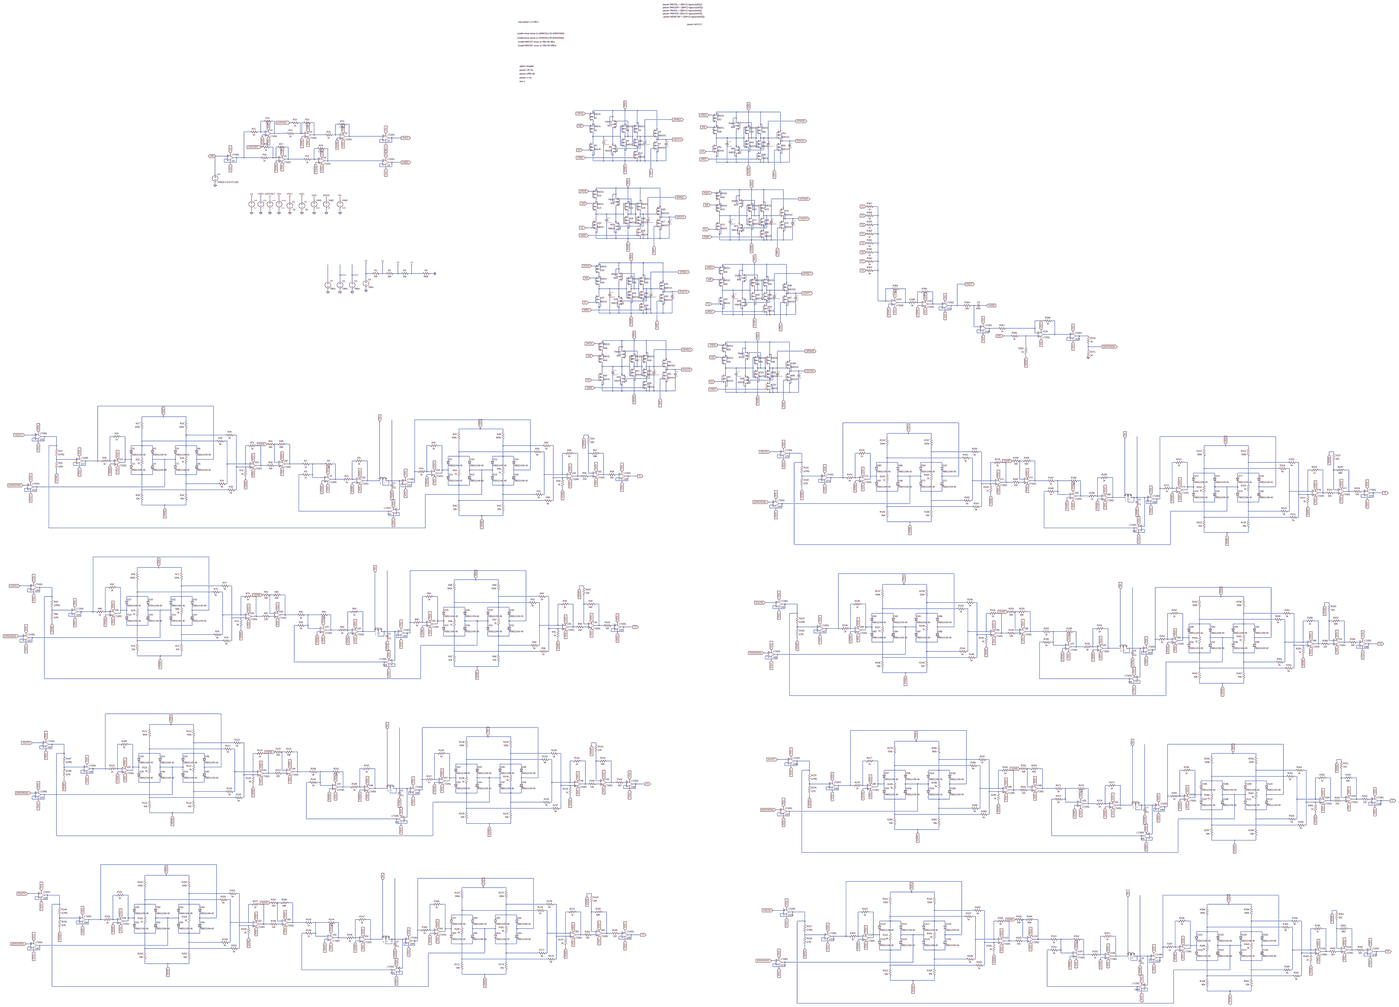
[diagram p0: schematic OZ_8_bounded_curves.asc, whole sheet]
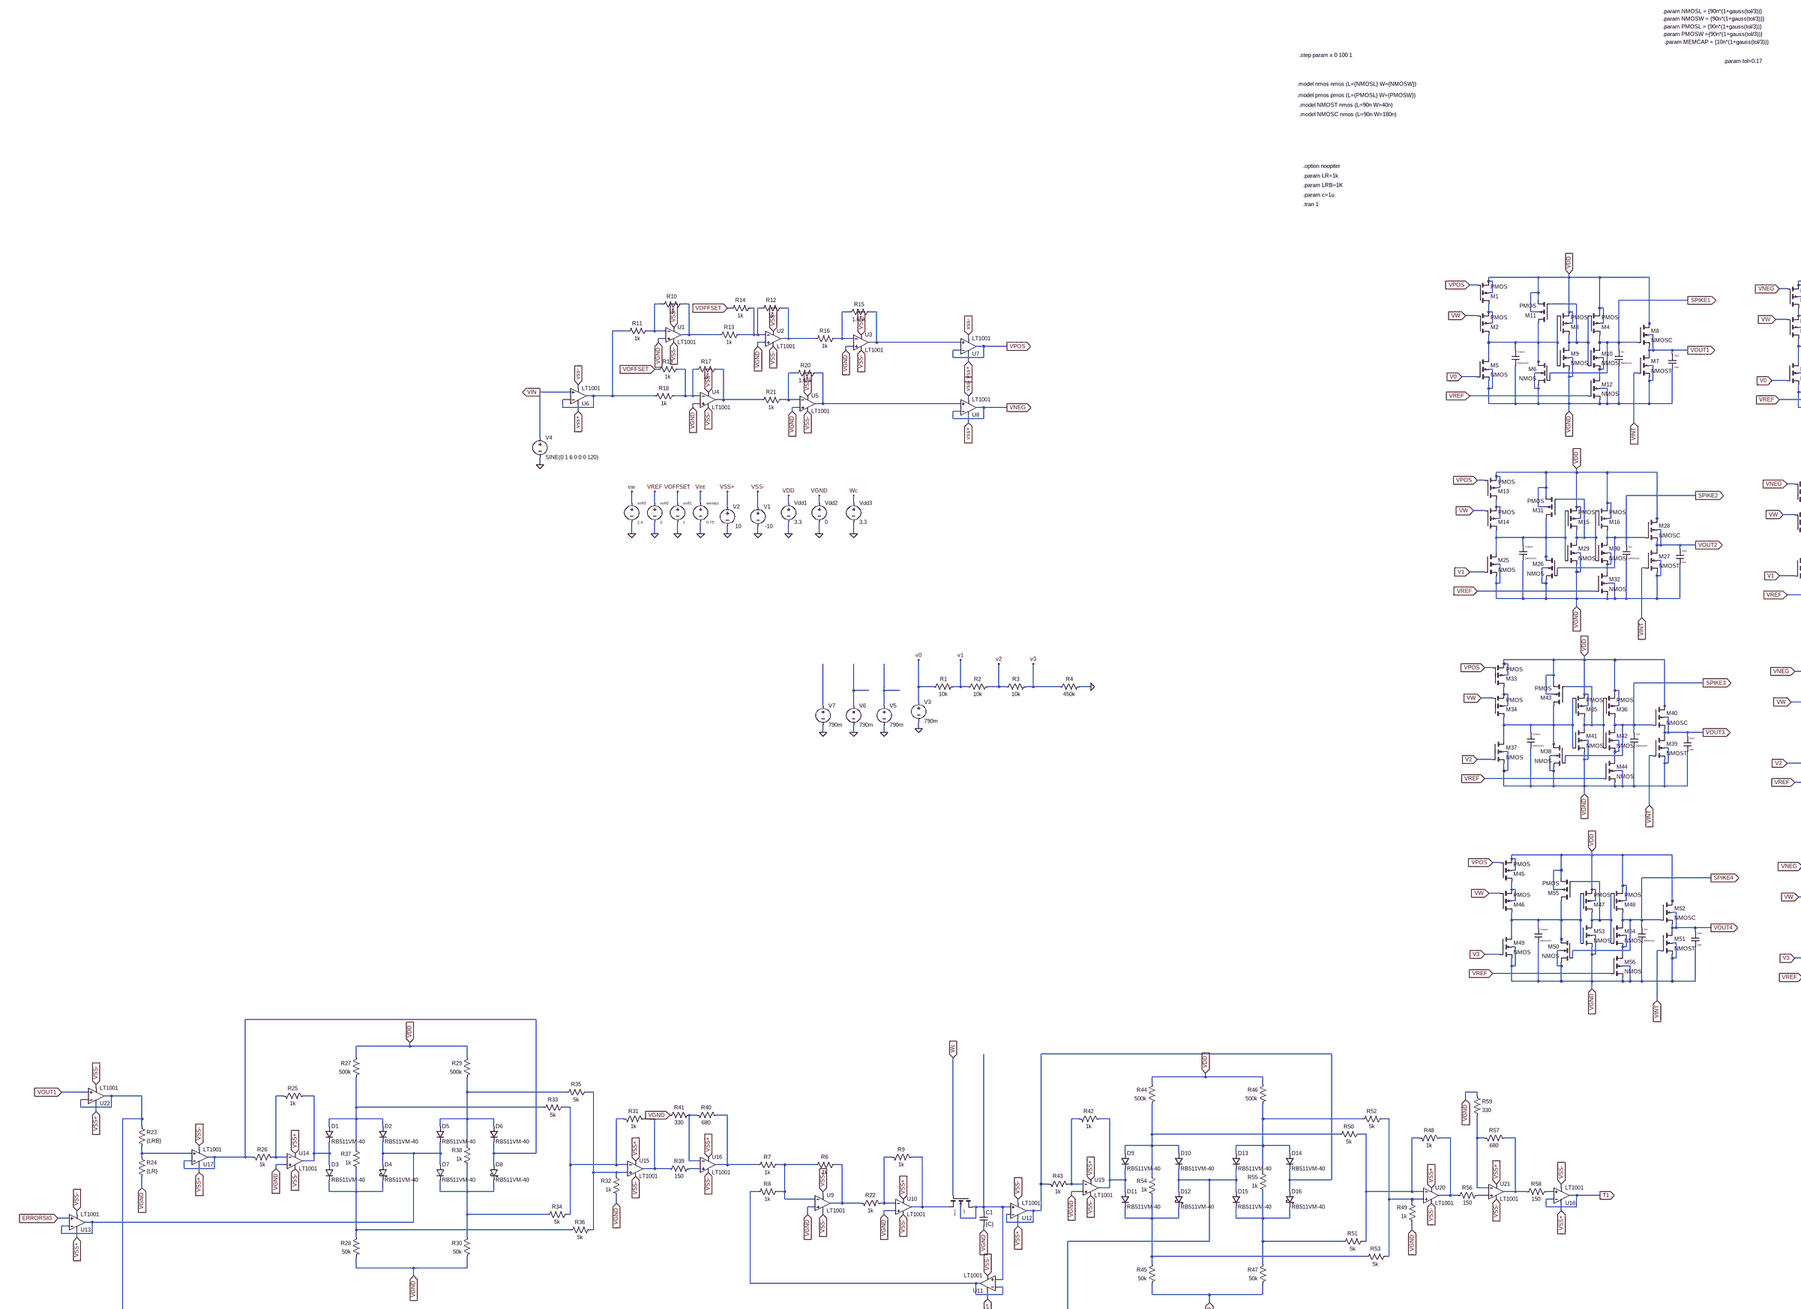
[diagram p1: schematic OZ_8_bounded_curves.asc, part, row 1 of 2, column 1 of 2]
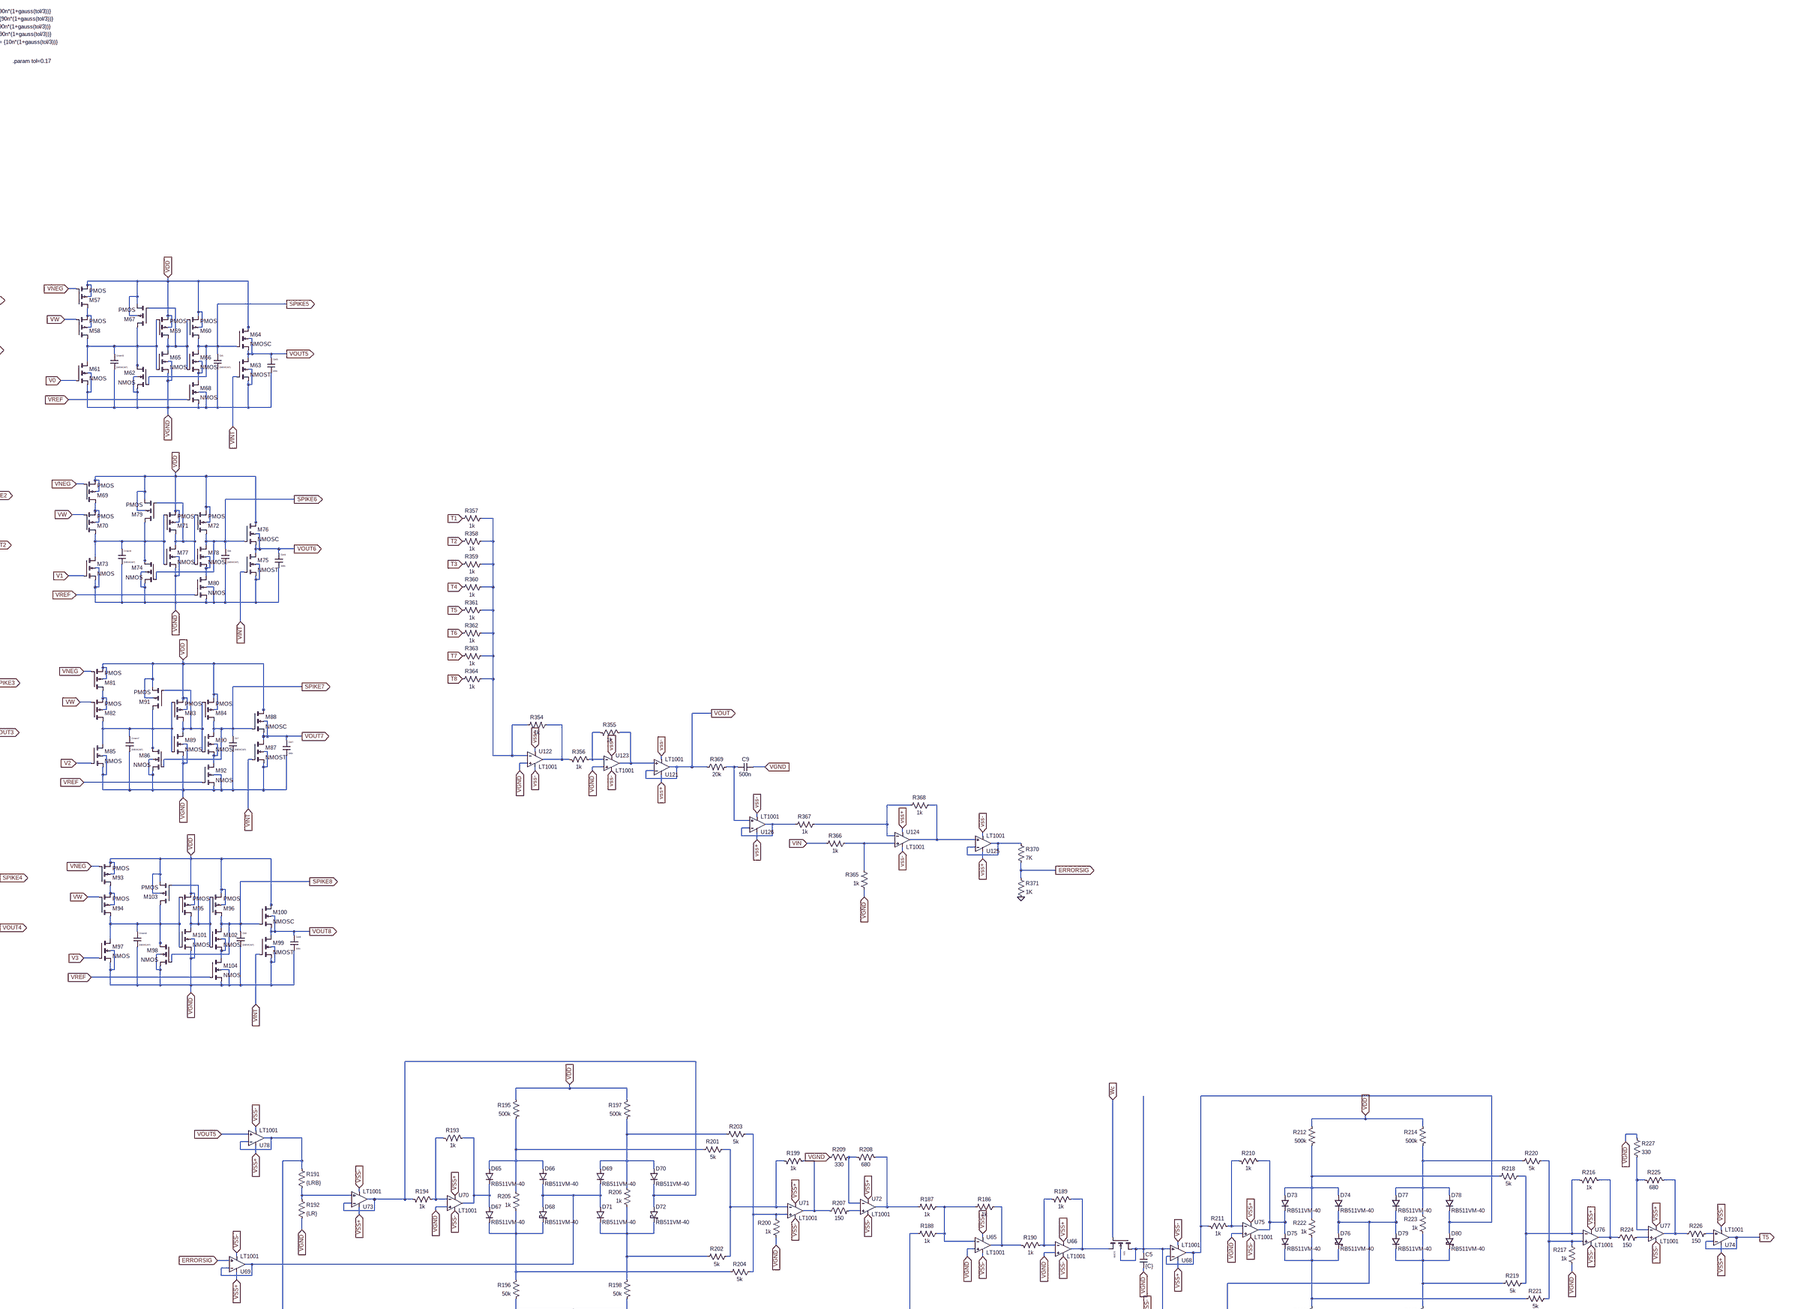
[diagram p2: schematic OZ_8_bounded_curves.asc, part, row 1 of 2, column 2 of 2]
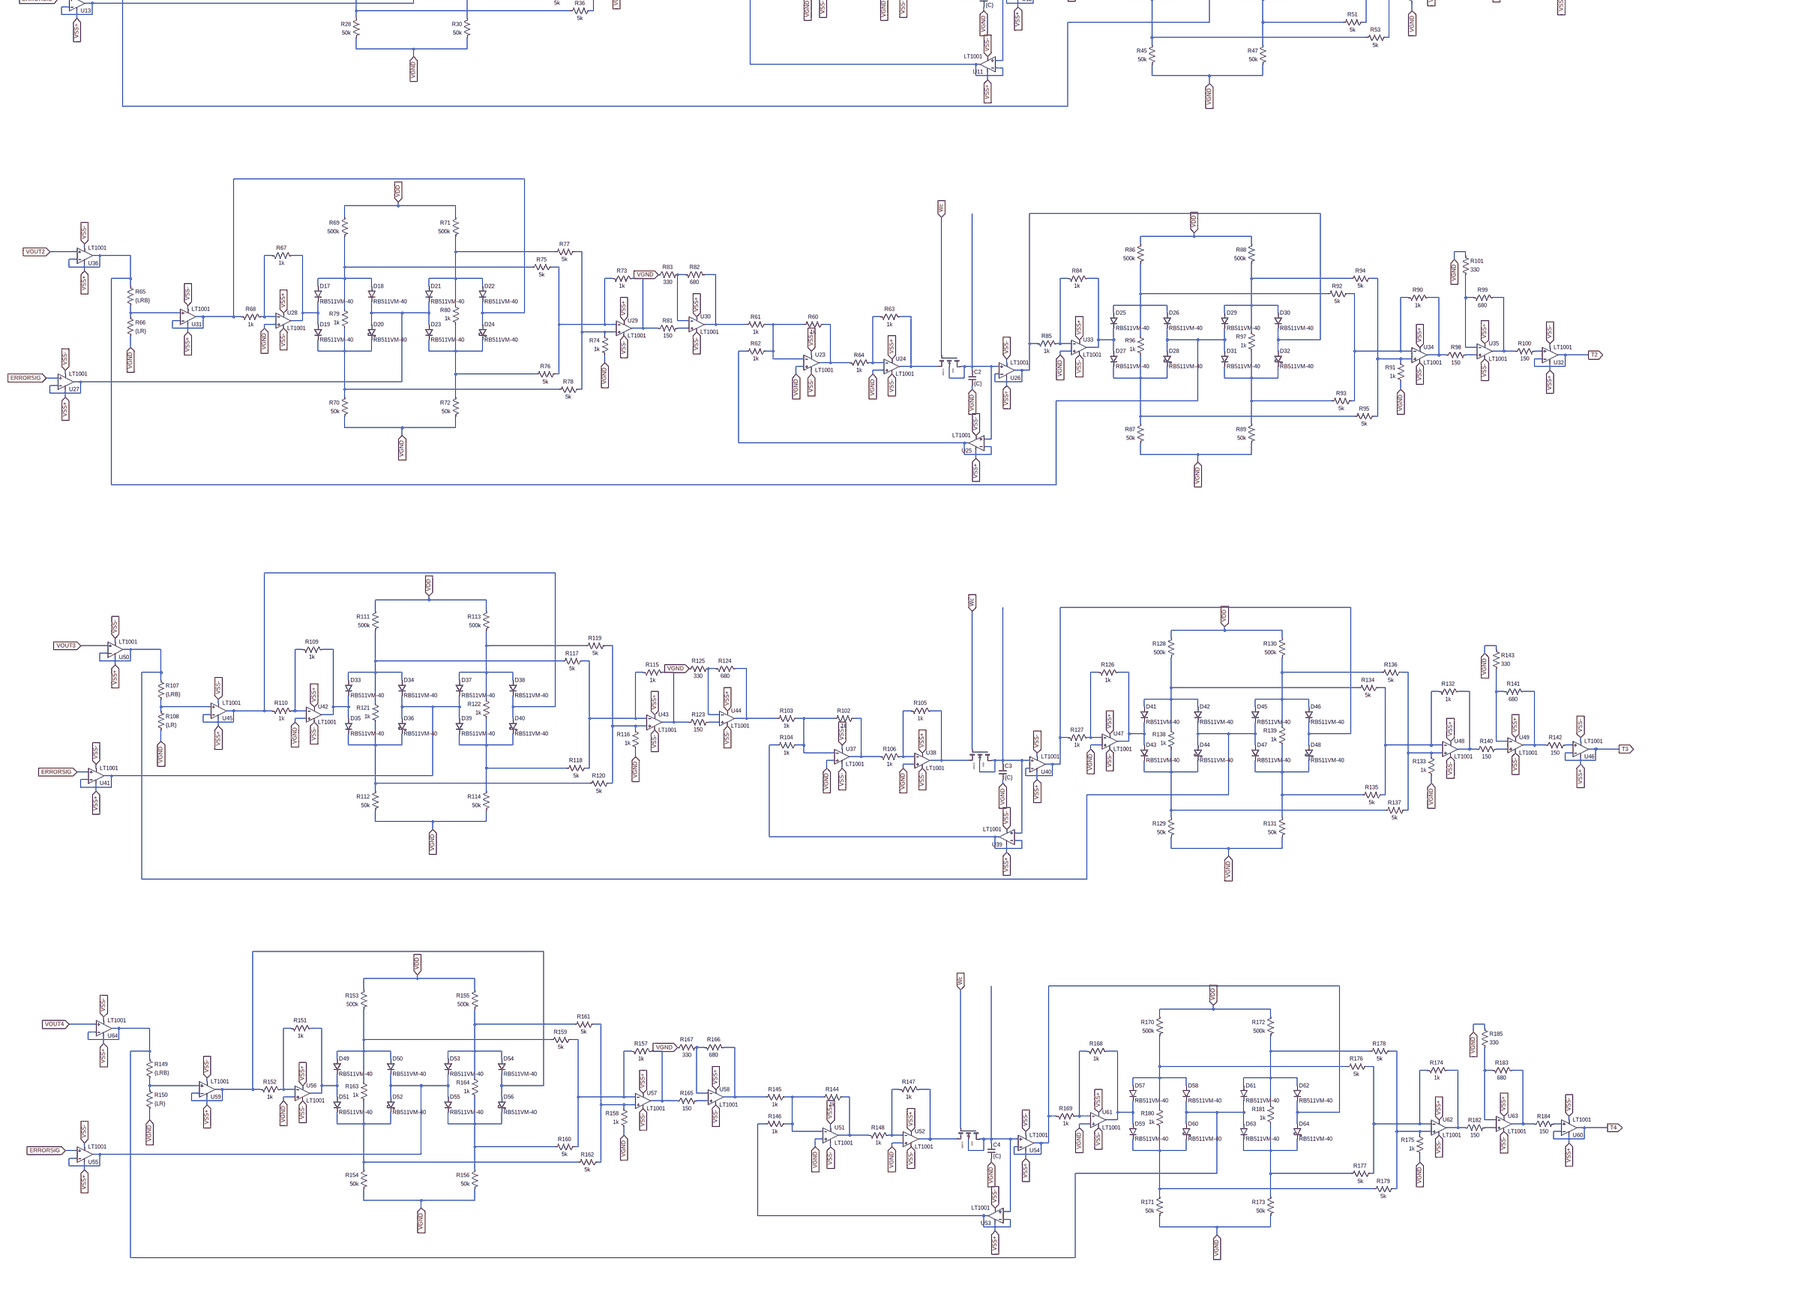
[diagram p3: schematic OZ_8_bounded_curves.asc, part, row 2 of 2, column 1 of 2]
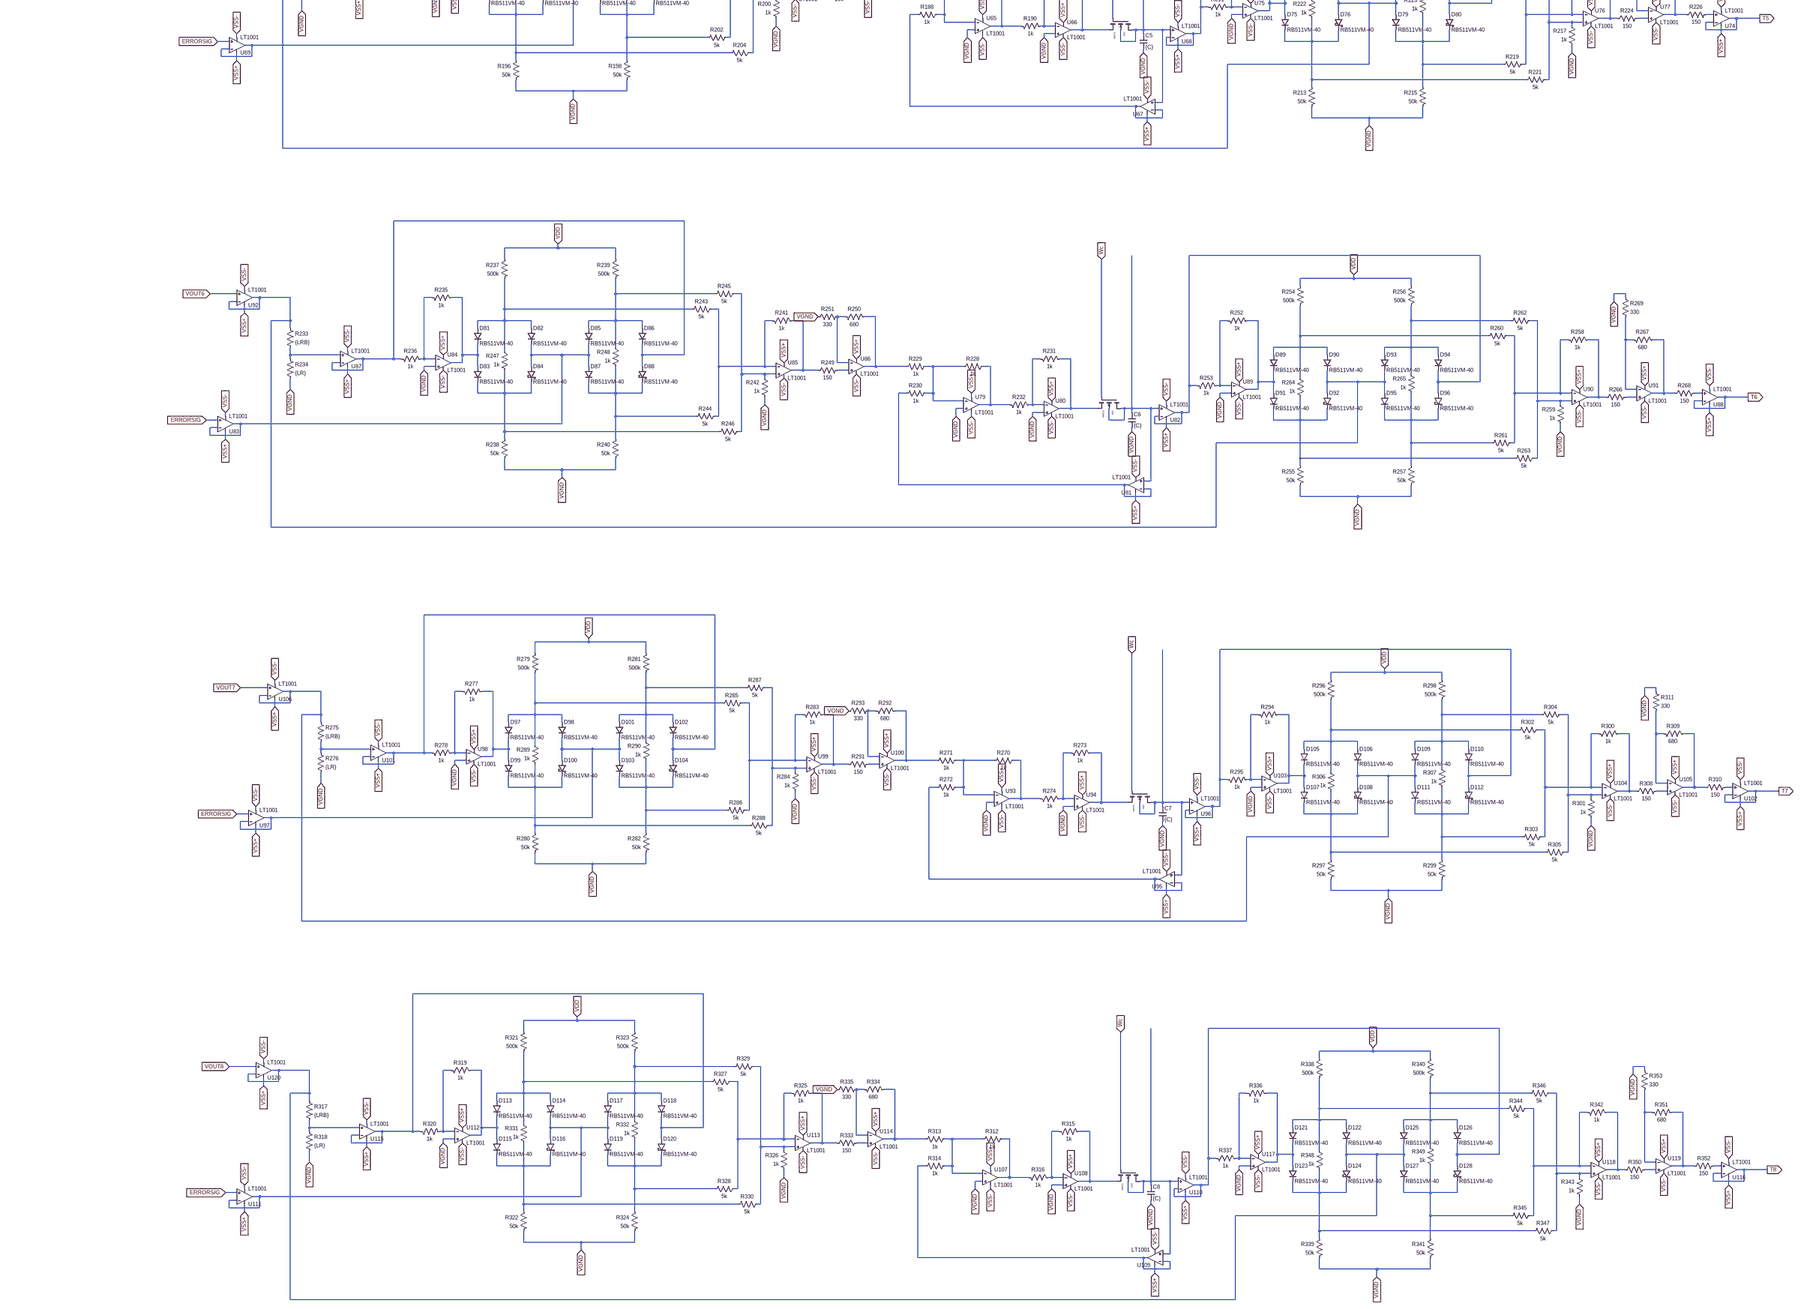
[diagram p4: schematic OZ_8_bounded_curves.asc, part, row 2 of 2, column 2 of 2]
* OZ_8_bounded_curves.asc
vtemp1 Vint 0 0.75
Vdd1 VDD 0 3.3
V1 VSS- 0 -10
V2 VSS+ 0 10
voff1 VOFFSET 0 1
voff2 VREF 0 2
voff3 vw 0 2.4
Vdd2 VGND 0 0
XU1 VGND N001 VSS+ VSS- N002 LT1001  ; pins In+ In- V+ V- OUT
R10 N002 N001 1k
R11 N001 N011 1k
XU2 VGND N004 VSS+ VSS- N005 LT1001  ; pins In+ In- V+ V- OUT
R12 N005 N004 1k
R13 N004 N002 1k
R14 N004 VOFFSET 1k
XU3 VGND N007 VSS+ VSS- N008 LT1001  ; pins In+ In- V+ V- OUT
R15 N008 N007 1.65k
R16 N007 N005 1k
XU4 VGND N016 VSS+ VSS- N017 LT1001  ; pins In+ In- V+ V- OUT
R17 N017 N016 1k
R18 N016 N011 1k
R19 N016 VOFFSET 1k
XU5 VGND N018 VSS+ VSS- N019 LT1001  ; pins In+ In- V+ V- OUT
R20 N019 N018 1.65k
R21 N018 N017 1k
XU6 VIN N011 VSS+ VSS- N011 LT1001  ; pins In+ In- V+ V- OUT
XU7 N008 VPOS VSS+ VSS- VPOS LT1001  ; pins In+ In- V+ V- OUT
XU8 N019 VNEG VSS+ VSS- VNEG LT1001  ; pins In+ In- V+ V- OUT
V4 VIN 0 SINE(0 1 6 0 0 0 120)
XU121 N040 VOUT VSS+ VSS- VOUT LT1001  ; pins In+ In- V+ V- OUT
XU122 VGND N024 VSS+ VSS- N037 LT1001  ; pins In+ In- V+ V- OUT
R354 N037 N024 1k
XU123 VGND N039 VSS+ VSS- N040 LT1001  ; pins In+ In- V+ V- OUT
R355 N039 N040 1k
R356 N037 N039 1k
R357 N024 T1 1k
R358 N024 T2 1k
R359 N024 T3 1k
R360 N024 T4 1k
R361 N024 T5 1k
R362 N024 T6 1k
R363 N024 T7 1k
R364 N024 T8 1k
M17 N115 Wc N090 N115 NMOS
C1 N115 VGND {C} IC=0
XU9 VGND N098 VSS+ VSS- N099 LT1001  ; pins In+ In- V+ V- OUT
R6 N099 N098 1k
R7 N098 N069 1k
R8 N098 N108 1k
XU10 VGND N089 VSS+ VSS- N090 LT1001  ; pins In+ In- V+ V- OUT
R9 N089 N090 1k
R22 N099 N089 1k
XU11 N115 N108 VSS+ VSS- N108 LT1001  ; pins In+ In- V+ V- OUT
XU12 N115 N058 VSS+ VSS- N058 LT1001  ; pins In+ In- V+ V- OUT
R23 N062 N087 {LRB}
R24 N087 VGND {LR}
XU13 ERRORSIG N088 VSS+ VSS- N088 LT1001  ; pins In+ In- V+ V- OUT
D1 N066 N064 RB511VM-40
XU14 VGND N063 VSS+ VSS- N064 LT1001  ; pins In+ In- V+ V- OUT
R25 N063 N064 1k
R26 N057 N063 1k
D2 N066 N088 RB511VM-40
D3 N064 N106 RB511VM-40
D4 N088 N106 RB511VM-40
R27 VDD N066 500k
R28 N106 VGND 50k
D5 N060 N088 RB511VM-40
D6 N060 N057 RB511VM-40
D7 N088 N107 RB511VM-40
D8 N057 N107 RB511VM-40
R29 VDD N060 500k
R30 N107 VGND 50k
XU15 N061 N067 VSS+ VSS- N070 LT1001  ; pins In+ In- V+ V- OUT
R31 N067 N070 1k
R32 VGND N061 1k
R33 N067 N066 5k
R34 N067 N107 5k
R35 N061 N060 5k
R36 N061 N106 5k
R37 N106 N066 1k
R38 N107 N060 1k
R39 N070 N100 150
XU16 N100 N068 VSS+ VSS- N069 LT1001  ; pins In+ In- V+ V- OUT
R40 N068 N069 680
R41 VGND N068 330
XU17 N087 N057 VSS+ VSS- N057 LT1001  ; pins In+ In- V+ V- OUT
XU18 N109 T1 VSS+ VSS- T1 LT1001  ; pins In+ In- V+ V- OUT
D9 N075 N072 RB511VM-40
XU19 VGND N071 VSS+ VSS- N072 LT1001  ; pins In+ In- V+ V- OUT
R42 N071 N072 1k
R43 N058 N071 1k
D10 N075 N062 RB511VM-40
D11 N072 N119 RB511VM-40
D12 N062 N119 RB511VM-40
R44 VDD N075 500k
R45 N119 VGND 50k
D13 N073 N062 RB511VM-40
D14 N073 N058 RB511VM-40
D15 N062 N120 RB511VM-40
D16 N058 N120 RB511VM-40
R46 VDD N073 500k
R47 N120 VGND 50k
XU20 N074 N076 VSS+ VSS- N079 LT1001  ; pins In+ In- V+ V- OUT
R48 N076 N079 1k
R49 VGND N074 1k
R50 N076 N075 5k
R51 N076 N120 5k
R52 N074 N073 5k
R53 N074 N119 5k
R54 N119 N075 1k
R55 N120 N073 1k
R56 N079 N110 150
XU21 N110 N080 VSS+ VSS- N081 LT1001  ; pins In+ In- V+ V- OUT
R57 N080 N081 680
R58 N081 N109 150
R59 VGND N080 330
XU22 VOUT1 N062 VSS+ VSS- N062 LT1001  ; pins In+ In- V+ V- OUT
M18 N187 Wc N162 N187 NMOS
C2 N187 VGND {C} IC=0
XU23 VGND N170 VSS+ VSS- N171 LT1001  ; pins In+ In- V+ V- OUT
R60 N171 N170 1k
R61 N170 N141 1k
R62 N170 N180 1k
XU24 VGND N161 VSS+ VSS- N162 LT1001  ; pins In+ In- V+ V- OUT
R63 N161 N162 1k
R64 N171 N161 1k
XU25 N187 N180 VSS+ VSS- N180 LT1001  ; pins In+ In- V+ V- OUT
XU26 N187 N130 VSS+ VSS- N130 LT1001  ; pins In+ In- V+ V- OUT
R65 N134 N159 {LRB}
R66 N159 VGND {LR}
XU27 ERRORSIG N160 VSS+ VSS- N160 LT1001  ; pins In+ In- V+ V- OUT
D17 N138 N136 RB511VM-40
XU28 VGND N135 VSS+ VSS- N136 LT1001  ; pins In+ In- V+ V- OUT
R67 N135 N136 1k
R68 N129 N135 1k
D18 N138 N160 RB511VM-40
D19 N136 N178 RB511VM-40
D20 N160 N178 RB511VM-40
R69 VDD N138 500k
R70 N178 VGND 50k
D21 N132 N160 RB511VM-40
D22 N132 N129 RB511VM-40
D23 N160 N179 RB511VM-40
D24 N129 N179 RB511VM-40
R71 VDD N132 500k
R72 N179 VGND 50k
XU29 N133 N139 VSS+ VSS- N142 LT1001  ; pins In+ In- V+ V- OUT
R73 N139 N142 1k
R74 VGND N133 1k
R75 N139 N138 5k
R76 N139 N179 5k
R77 N133 N132 5k
R78 N133 N178 5k
R79 N178 N138 1k
R80 N179 N132 1k
R81 N142 N172 150
XU30 N172 N140 VSS+ VSS- N141 LT1001  ; pins In+ In- V+ V- OUT
R82 N140 N141 680
R83 VGND N140 330
XU31 N159 N129 VSS+ VSS- N129 LT1001  ; pins In+ In- V+ V- OUT
XU32 N181 T2 VSS+ VSS- T2 LT1001  ; pins In+ In- V+ V- OUT
D25 N147 N144 RB511VM-40
XU33 VGND N143 VSS+ VSS- N144 LT1001  ; pins In+ In- V+ V- OUT
R84 N143 N144 1k
R85 N130 N143 1k
D26 N147 N134 RB511VM-40
D27 N144 N191 RB511VM-40
D28 N134 N191 RB511VM-40
R86 VDD N147 500k
R87 N191 VGND 50k
D29 N145 N134 RB511VM-40
D30 N145 N130 RB511VM-40
D31 N134 N192 RB511VM-40
D32 N130 N192 RB511VM-40
R88 VDD N145 500k
R89 N192 VGND 50k
XU34 N146 N148 VSS+ VSS- N151 LT1001  ; pins In+ In- V+ V- OUT
R90 N148 N151 1k
R91 VGND N146 1k
R92 N148 N147 5k
R93 N148 N192 5k
R94 N146 N145 5k
R95 N146 N191 5k
R96 N191 N147 1k
R97 N192 N145 1k
R98 N151 N182 150
XU35 N182 N152 VSS+ VSS- N153 LT1001  ; pins In+ In- V+ V- OUT
R99 N152 N153 680
R100 N153 N181 150
R101 VGND N152 330
XU36 VOUT2 N134 VSS+ VSS- N134 LT1001  ; pins In+ In- V+ V- OUT
M19 N259 Wc N234 N259 NMOS
C3 N259 VGND {C} IC=0
XU37 VGND N242 VSS+ VSS- N243 LT1001  ; pins In+ In- V+ V- OUT
R102 N243 N242 1k
R103 N242 N213 1k
R104 N242 N252 1k
XU38 VGND N233 VSS+ VSS- N234 LT1001  ; pins In+ In- V+ V- OUT
R105 N233 N234 1k
R106 N243 N233 1k
XU39 N259 N252 VSS+ VSS- N252 LT1001  ; pins In+ In- V+ V- OUT
XU40 N259 N202 VSS+ VSS- N202 LT1001  ; pins In+ In- V+ V- OUT
R107 N206 N231 {LRB}
R108 N231 VGND {LR}
XU41 ERRORSIG N232 VSS+ VSS- N232 LT1001  ; pins In+ In- V+ V- OUT
D33 N210 N208 RB511VM-40
XU42 VGND N207 VSS+ VSS- N208 LT1001  ; pins In+ In- V+ V- OUT
R109 N207 N208 1k
R110 N201 N207 1k
D34 N210 N232 RB511VM-40
D35 N208 N250 RB511VM-40
D36 N232 N250 RB511VM-40
R111 VDD N210 500k
R112 N250 VGND 50k
D37 N204 N232 RB511VM-40
D38 N204 N201 RB511VM-40
D39 N232 N251 RB511VM-40
D40 N201 N251 RB511VM-40
R113 VDD N204 500k
R114 N251 VGND 50k
XU43 N205 N211 VSS+ VSS- N214 LT1001  ; pins In+ In- V+ V- OUT
R115 N211 N214 1k
R116 VGND N205 1k
R117 N211 N210 5k
R118 N211 N251 5k
R119 N205 N204 5k
R120 N205 N250 5k
R121 N250 N210 1k
R122 N251 N204 1k
R123 N214 N244 150
XU44 N244 N212 VSS+ VSS- N213 LT1001  ; pins In+ In- V+ V- OUT
R124 N212 N213 680
R125 VGND N212 330
XU45 N231 N201 VSS+ VSS- N201 LT1001  ; pins In+ In- V+ V- OUT
XU46 N253 T3 VSS+ VSS- T3 LT1001  ; pins In+ In- V+ V- OUT
D41 N219 N216 RB511VM-40
XU47 VGND N215 VSS+ VSS- N216 LT1001  ; pins In+ In- V+ V- OUT
R126 N215 N216 1k
R127 N202 N215 1k
D42 N219 N206 RB511VM-40
D43 N216 N263 RB511VM-40
D44 N206 N263 RB511VM-40
R128 VDD N219 500k
R129 N263 VGND 50k
D45 N217 N206 RB511VM-40
D46 N217 N202 RB511VM-40
D47 N206 N264 RB511VM-40
D48 N202 N264 RB511VM-40
R130 VDD N217 500k
R131 N264 VGND 50k
XU48 N218 N220 VSS+ VSS- N223 LT1001  ; pins In+ In- V+ V- OUT
R132 N220 N223 1k
R133 VGND N218 1k
R134 N220 N219 5k
R135 N220 N264 5k
R136 N218 N217 5k
R137 N218 N263 5k
R138 N263 N219 1k
R139 N264 N217 1k
R140 N223 N254 150
XU49 N254 N224 VSS+ VSS- N225 LT1001  ; pins In+ In- V+ V- OUT
R141 N224 N225 680
R142 N225 N253 150
R143 VGND N224 330
XU50 VOUT3 N206 VSS+ VSS- N206 LT1001  ; pins In+ In- V+ V- OUT
M20 N331 Wc N306 N331 NMOS
C4 N331 VGND {C} IC=0
XU51 VGND N314 VSS+ VSS- N315 LT1001  ; pins In+ In- V+ V- OUT
R144 N315 N314 1k
R145 N314 N285 1k
R146 N314 N324 1k
XU52 VGND N305 VSS+ VSS- N306 LT1001  ; pins In+ In- V+ V- OUT
R147 N305 N306 1k
R148 N315 N305 1k
XU53 N331 N324 VSS+ VSS- N324 LT1001  ; pins In+ In- V+ V- OUT
XU54 N331 N274 VSS+ VSS- N274 LT1001  ; pins In+ In- V+ V- OUT
R149 N278 N303 {LRB}
R150 N303 VGND {LR}
XU55 ERRORSIG N304 VSS+ VSS- N304 LT1001  ; pins In+ In- V+ V- OUT
D49 N282 N280 RB511VM-40
XU56 VGND N279 VSS+ VSS- N280 LT1001  ; pins In+ In- V+ V- OUT
R151 N279 N280 1k
R152 N273 N279 1k
D50 N282 N304 RB511VM-40
D51 N280 N322 RB511VM-40
D52 N304 N322 RB511VM-40
R153 VDD N282 500k
R154 N322 VGND 50k
D53 N276 N304 RB511VM-40
D54 N276 N273 RB511VM-40
D55 N304 N323 RB511VM-40
D56 N273 N323 RB511VM-40
R155 VDD N276 500k
R156 N323 VGND 50k
XU57 N277 N283 VSS+ VSS- N286 LT1001  ; pins In+ In- V+ V- OUT
R157 N283 N286 1k
R158 VGND N277 1k
R159 N283 N282 5k
R160 N283 N323 5k
R161 N277 N276 5k
R162 N277 N322 5k
R163 N322 N282 1k
R164 N323 N276 1k
R165 N286 N316 150
XU58 N316 N284 VSS+ VSS- N285 LT1001  ; pins In+ In- V+ V- OUT
R166 N284 N285 680
R167 VGND N284 330
XU59 N303 N273 VSS+ VSS- N273 LT1001  ; pins In+ In- V+ V- OUT
XU60 N325 T4 VSS+ VSS- T4 LT1001  ; pins In+ In- V+ V- OUT
D57 N291 N288 RB511VM-40
XU61 VGND N287 VSS+ VSS- N288 LT1001  ; pins In+ In- V+ V- OUT
R168 N287 N288 1k
R169 N274 N287 1k
D58 N291 N278 RB511VM-40
D59 N288 N335 RB511VM-40
D60 N278 N335 RB511VM-40
R170 VDD N291 500k
R171 N335 VGND 50k
D61 N289 N278 RB511VM-40
D62 N289 N274 RB511VM-40
D63 N278 N336 RB511VM-40
D64 N274 N336 RB511VM-40
R172 VDD N289 500k
R173 N336 VGND 50k
XU62 N290 N292 VSS+ VSS- N295 LT1001  ; pins In+ In- V+ V- OUT
R174 N292 N295 1k
R175 VGND N290 1k
R176 N292 N291 5k
R177 N292 N336 5k
R178 N290 N289 5k
R179 N290 N335 5k
R180 N335 N291 1k
R181 N336 N289 1k
R182 N295 N326 150
XU63 N326 N296 VSS+ VSS- N297 LT1001  ; pins In+ In- V+ V- OUT
R183 N296 N297 680
R184 N297 N325 150
R185 VGND N296 330
XU64 VOUT4 N278 VSS+ VSS- N278 LT1001  ; pins In+ In- V+ V- OUT
M21 N126 Wc N114 N126 NMOS
C5 N126 VGND {C} IC=0
XU65 VGND N116 VSS+ VSS- N117 LT1001  ; pins In+ In- V+ V- OUT
R186 N117 N116 1k
R187 N116 N092 1k
R188 N116 N123 1k
XU66 VGND N113 VSS+ VSS- N114 LT1001  ; pins In+ In- V+ V- OUT
R189 N113 N114 1k
R190 N117 N113 1k
XU67 N126 N123 VSS+ VSS- N123 LT1001  ; pins In+ In- V+ V- OUT
XU68 N126 N065 VSS+ VSS- N065 LT1001  ; pins In+ In- V+ V- OUT
R191 N082 N111 {LRB}
R192 N111 VGND {LR}
XU69 ERRORSIG N112 VSS+ VSS- N112 LT1001  ; pins In+ In- V+ V- OUT
D65 N085 N084 RB511VM-40
XU70 VGND N083 VSS+ VSS- N084 LT1001  ; pins In+ In- V+ V- OUT
R193 N083 N084 1k
R194 N059 N083 1k
D66 N085 N112 RB511VM-40
D67 N084 N121 RB511VM-40
D68 N112 N121 RB511VM-40
R195 VDD N085 500k
R196 N121 VGND 50k
D69 N077 N112 RB511VM-40
D70 N077 N059 RB511VM-40
D71 N112 N122 RB511VM-40
D72 N059 N122 RB511VM-40
R197 VDD N077 500k
R198 N122 VGND 50k
XU71 N078 N086 VSS+ VSS- N093 LT1001  ; pins In+ In- V+ V- OUT
R199 N086 N093 1k
R200 VGND N078 1k
R201 N086 N085 5k
R202 N086 N122 5k
R203 N078 N077 5k
R204 N078 N121 5k
R205 N121 N085 1k
R206 N122 N077 1k
R207 N093 N118 150
XU72 N118 N091 VSS+ VSS- N092 LT1001  ; pins In+ In- V+ V- OUT
R208 N091 N092 680
R209 VGND N091 330
XU73 N111 N059 VSS+ VSS- N059 LT1001  ; pins In+ In- V+ V- OUT
XU74 N124 T5 VSS+ VSS- T5 LT1001  ; pins In+ In- V+ V- OUT
D73 N101 N095 RB511VM-40
XU75 VGND N094 VSS+ VSS- N095 LT1001  ; pins In+ In- V+ V- OUT
R210 N094 N095 1k
R211 N065 N094 1k
D74 N101 N082 RB511VM-40
D75 N095 N127 RB511VM-40
D76 N082 N127 RB511VM-40
R212 VDD N101 500k
R213 N127 VGND 50k
D77 N096 N082 RB511VM-40
D78 N096 N065 RB511VM-40
D79 N082 N128 RB511VM-40
D80 N065 N128 RB511VM-40
R214 VDD N096 500k
R215 N128 VGND 50k
XU76 N097 N102 VSS+ VSS- N103 LT1001  ; pins In+ In- V+ V- OUT
R216 N102 N103 1k
R217 VGND N097 1k
R218 N102 N101 5k
R219 N102 N128 5k
R220 N097 N096 5k
R221 N097 N127 5k
R222 N127 N101 1k
R223 N128 N096 1k
R224 N103 N125 150
XU77 N125 N104 VSS+ VSS- N105 LT1001  ; pins In+ In- V+ V- OUT
R225 N104 N105 680
R226 N105 N124 150
R227 VGND N104 330
XU78 VOUT5 N082 VSS+ VSS- N082 LT1001  ; pins In+ In- V+ V- OUT
M22 N198 Wc N186 N198 NMOS
C6 N198 VGND {C} IC=0
XU79 VGND N188 VSS+ VSS- N189 LT1001  ; pins In+ In- V+ V- OUT
R228 N189 N188 1k
R229 N188 N164 1k
R230 N188 N195 1k
XU80 VGND N185 VSS+ VSS- N186 LT1001  ; pins In+ In- V+ V- OUT
R231 N185 N186 1k
R232 N189 N185 1k
XU81 N198 N195 VSS+ VSS- N195 LT1001  ; pins In+ In- V+ V- OUT
XU82 N198 N137 VSS+ VSS- N137 LT1001  ; pins In+ In- V+ V- OUT
R233 N154 N183 {LRB}
R234 N183 VGND {LR}
XU83 ERRORSIG N184 VSS+ VSS- N184 LT1001  ; pins In+ In- V+ V- OUT
D81 N157 N156 RB511VM-40
XU84 VGND N155 VSS+ VSS- N156 LT1001  ; pins In+ In- V+ V- OUT
R235 N155 N156 1k
R236 N131 N155 1k
D82 N157 N184 RB511VM-40
D83 N156 N193 RB511VM-40
D84 N184 N193 RB511VM-40
R237 VDD N157 500k
R238 N193 VGND 50k
D85 N149 N184 RB511VM-40
D86 N149 N131 RB511VM-40
D87 N184 N194 RB511VM-40
D88 N131 N194 RB511VM-40
R239 VDD N149 500k
R240 N194 VGND 50k
XU85 N150 N158 VSS+ VSS- N165 LT1001  ; pins In+ In- V+ V- OUT
R241 N158 N165 1k
R242 VGND N150 1k
R243 N158 N157 5k
R244 N158 N194 5k
R245 N150 N149 5k
R246 N150 N193 5k
R247 N193 N157 1k
R248 N194 N149 1k
R249 N165 N190 150
XU86 N190 N163 VSS+ VSS- N164 LT1001  ; pins In+ In- V+ V- OUT
R250 N163 N164 680
R251 VGND N163 330
XU87 N183 N131 VSS+ VSS- N131 LT1001  ; pins In+ In- V+ V- OUT
XU88 N196 T6 VSS+ VSS- T6 LT1001  ; pins In+ In- V+ V- OUT
D89 N173 N167 RB511VM-40
XU89 VGND N166 VSS+ VSS- N167 LT1001  ; pins In+ In- V+ V- OUT
R252 N166 N167 1k
R253 N137 N166 1k
D90 N173 N154 RB511VM-40
D91 N167 N199 RB511VM-40
D92 N154 N199 RB511VM-40
R254 VDD N173 500k
R255 N199 VGND 50k
D93 N168 N154 RB511VM-40
D94 N168 N137 RB511VM-40
D95 N154 N200 RB511VM-40
D96 N137 N200 RB511VM-40
R256 VDD N168 500k
R257 N200 VGND 50k
XU90 N169 N174 VSS+ VSS- N175 LT1001  ; pins In+ In- V+ V- OUT
R258 N174 N175 1k
R259 VGND N169 1k
R260 N174 N173 5k
R261 N174 N200 5k
R262 N169 N168 5k
R263 N169 N199 5k
R264 N199 N173 1k
R265 N200 N168 1k
R266 N175 N197 150
XU91 N197 N176 VSS+ VSS- N177 LT1001  ; pins In+ In- V+ V- OUT
R267 N176 N177 680
R268 N177 N196 150
R269 VGND N176 330
XU92 VOUT6 N154 VSS+ VSS- N154 LT1001  ; pins In+ In- V+ V- OUT
M23 N270 Wc N258 N270 NMOS
C7 N270 VGND {C} IC=0
XU93 VGND N260 VSS+ VSS- N261 LT1001  ; pins In+ In- V+ V- OUT
R270 N261 N260 1k
R271 N260 N236 1k
R272 N260 N267 1k
XU94 VGND N257 VSS+ VSS- N258 LT1001  ; pins In+ In- V+ V- OUT
R273 N257 N258 1k
R274 N261 N257 1k
XU95 N270 N267 VSS+ VSS- N267 LT1001  ; pins In+ In- V+ V- OUT
XU96 N270 N209 VSS+ VSS- N209 LT1001  ; pins In+ In- V+ V- OUT
R275 N226 N255 {LRB}
R276 N255 VGND {LR}
XU97 ERRORSIG N256 VSS+ VSS- N256 LT1001  ; pins In+ In- V+ V- OUT
D97 N229 N228 RB511VM-40
XU98 VGND N227 VSS+ VSS- N228 LT1001  ; pins In+ In- V+ V- OUT
R277 N227 N228 1k
R278 N203 N227 1k
D98 N229 N256 RB511VM-40
D99 N228 N265 RB511VM-40
D100 N256 N265 RB511VM-40
R279 VDD N229 500k
R280 N265 VGND 50k
D101 N221 N256 RB511VM-40
D102 N221 N203 RB511VM-40
D103 N256 N266 RB511VM-40
D104 N203 N266 RB511VM-40
R281 VDD N221 500k
R282 N266 VGND 50k
XU99 N222 N230 VSS+ VSS- N237 LT1001  ; pins In+ In- V+ V- OUT
R283 N230 N237 1k
R284 VGND N222 1k
R285 N230 N229 5k
R286 N230 N266 5k
R287 N222 N221 5k
R288 N222 N265 5k
R289 N265 N229 1k
R290 N266 N221 1k
R291 N237 N262 150
XU100 N262 N235 VSS+ VSS- N236 LT1001  ; pins In+ In- V+ V- OUT
R292 N235 N236 680
R293 VGND N235 330
XU101 N255 N203 VSS+ VSS- N203 LT1001  ; pins In+ In- V+ V- OUT
XU102 N268 T7 VSS+ VSS- T7 LT1001  ; pins In+ In- V+ V- OUT
D105 N245 N239 RB511VM-40
XU103 VGND N238 VSS+ VSS- N239 LT1001  ; pins In+ In- V+ V- OUT
R294 N238 N239 1k
R295 N209 N238 1k
D106 N245 N226 RB511VM-40
D107 N239 N271 RB511VM-40
D108 N226 N271 RB511VM-40
R296 VDD N245 500k
R297 N271 VGND 50k
D109 N240 N226 RB511VM-40
D110 N240 N209 RB511VM-40
D111 N226 N272 RB511VM-40
D112 N209 N272 RB511VM-40
R298 VDD N240 500k
R299 N272 VGND 50k
XU104 N241 N246 VSS+ VSS- N247 LT1001  ; pins In+ In- V+ V- OUT
R300 N246 N247 1k
R301 VGND N241 1k
R302 N246 N245 5k
R303 N246 N272 5k
R304 N241 N240 5k
R305 N241 N271 5k
R306 N271 N245 1k
R307 N272 N240 1k
R308 N247 N269 150
XU105 N269 N248 VSS+ VSS- N249 LT1001  ; pins In+ In- V+ V- OUT
R309 N248 N249 680
R310 N249 N268 150
R311 VGND N248 330
XU106 VOUT7 N226 VSS+ VSS- N226 LT1001  ; pins In+ In- V+ V- OUT
M24 N342 Wc N330 N342 NMOS
C8 N342 VGND {C} IC=0
XU107 VGND N332 VSS+ VSS- N333 LT1001  ; pins In+ In- V+ V- OUT
R312 N333 N332 1k
R313 N332 N308 1k
R314 N332 N339 1k
XU108 VGND N329 VSS+ VSS- N330 LT1001  ; pins In+ In- V+ V- OUT
R315 N329 N330 1k
R316 N333 N329 1k
XU109 N342 N339 VSS+ VSS- N339 LT1001  ; pins In+ In- V+ V- OUT
XU110 N342 N281 VSS+ VSS- N281 LT1001  ; pins In+ In- V+ V- OUT
R317 N298 N327 {LRB}
R318 N327 VGND {LR}
XU111 ERRORSIG N328 VSS+ VSS- N328 LT1001  ; pins In+ In- V+ V- OUT
D113 N301 N300 RB511VM-40
XU112 VGND N299 VSS+ VSS- N300 LT1001  ; pins In+ In- V+ V- OUT
R319 N299 N300 1k
R320 N275 N299 1k
D114 N301 N328 RB511VM-40
D115 N300 N337 RB511VM-40
D116 N328 N337 RB511VM-40
R321 VDD N301 500k
R322 N337 VGND 50k
D117 N293 N328 RB511VM-40
D118 N293 N275 RB511VM-40
D119 N328 N338 RB511VM-40
D120 N275 N338 RB511VM-40
R323 VDD N293 500k
R324 N338 VGND 50k
XU113 N294 N302 VSS+ VSS- N309 LT1001  ; pins In+ In- V+ V- OUT
R325 N302 N309 1k
R326 VGND N294 1k
R327 N302 N301 5k
R328 N302 N338 5k
R329 N294 N293 5k
R330 N294 N337 5k
R331 N337 N301 1k
R332 N338 N293 1k
R333 N309 N334 150
XU114 N334 N307 VSS+ VSS- N308 LT1001  ; pins In+ In- V+ V- OUT
R334 N307 N308 680
R335 VGND N307 330
XU115 N327 N275 VSS+ VSS- N275 LT1001  ; pins In+ In- V+ V- OUT
XU116 N340 T8 VSS+ VSS- T8 LT1001  ; pins In+ In- V+ V- OUT
D121 N317 N311 RB511VM-40
XU117 VGND N310 VSS+ VSS- N311 LT1001  ; pins In+ In- V+ V- OUT
R336 N310 N311 1k
R337 N281 N310 1k
D122 N317 N298 RB511VM-40
D123 N311 N343 RB511VM-40
D124 N298 N343 RB511VM-40
R338 VDD N317 500k
R339 N343 VGND 50k
D125 N312 N298 RB511VM-40
D126 N312 N281 RB511VM-40
D127 N298 N344 RB511VM-40
D128 N281 N344 RB511VM-40
R340 VDD N312 500k
R341 N344 VGND 50k
XU118 N313 N318 VSS+ VSS- N319 LT1001  ; pins In+ In- V+ V- OUT
R342 N318 N319 1k
R343 VGND N313 1k
R344 N318 N317 5k
R345 N318 N344 5k
R346 N313 N312 5k
R347 N313 N343 5k
R348 N343 N317 1k
R349 N344 N312 1k
R350 N319 N341 150
XU119 N341 N320 VSS+ VSS- N321 LT1001  ; pins In+ In- V+ V- OUT
R351 N320 N321 680
R352 N321 N340 150
R353 VGND N320 330
XU120 VOUT8 N298 VSS+ VSS- N298 LT1001  ; pins In+ In- V+ V- OUT
XU124 N047 N044 VSS+ VSS- N045 LT1001  ; pins In+ In- V+ V- OUT
R365 VGND N047 1k
R366 N047 VIN 1k
R367 N044 N046 1k
R368 N045 N044 1k
XU125 N045 N048 VSS+ VSS- N048 LT1001  ; pins In+ In- V+ V- OUT
R369 VOUT N043 20k
C9 N043 VGND 500n IC=0
XU126 N043 N046 VSS+ VSS- N046 LT1001  ; pins In+ In- V+ V- OUT
R370 N048 ERRORSIG 7K
R371 ERRORSIG 0 1K
Vdd3 Wc 0 3.3
Cmem1 N012 VGND {MEMCAP} V=4 Irms=162m Rser=0.395426 Lser=0 mfg="KEMET" pn="C0402C103K7PAC" type="X5R" IC=0
Ck1 SPIKE1 VGND {MEMCAP}
Cint1 VOUT1 VGND 100n
M1 N009 VPOS VDD VDD PMOS
M2 N012 vw N009 N009 PMOS
M3 N003 N012 VDD VDD PMOS
M4 SPIKE1 N003 VDD VDD PMOS
M5 N012 V0 VGND VGND NMOS
M6 N012 SPIKE1 VGND VGND NMOS
M7 VOUT1 Vint VGND VGND NMOST
M8 VDD SPIKE1 VOUT1 VOUT1 NMOSC
M9 N003 N012 VGND VGND NMOS
M10 SPIKE1 N003 N014 N014 NMOS
M11 N012 N003 VDD VDD PMOS
M12 N014 VREF VGND VGND NMOS
Cmem2 N025 VGND {MEMCAP} V=4 Irms=162m Rser=0.395426 Lser=0 mfg="KEMET" pn="C0402C103K7PAC" type="X5R" IC=0
Ck2 SPIKE2 VGND {MEMCAP}
Cint2 VOUT2 VGND 100n
M13 N022 VPOS VDD VDD PMOS
M14 N025 vw N022 N022 PMOS
M15 N020 N025 VDD VDD PMOS
M16 SPIKE2 N020 VDD VDD PMOS
M25 N025 V1 VGND VGND NMOS
M26 N025 SPIKE2 VGND VGND NMOS
M27 VOUT2 Vint VGND VGND NMOST
M28 VDD SPIKE2 VOUT2 VOUT2 NMOSC
M29 N020 N025 VGND VGND NMOS
M30 SPIKE2 N020 N027 N027 NMOS
M31 N025 N020 VDD VDD PMOS
M32 N027 VREF VGND VGND NMOS
Cmem3 N036 VGND {MEMCAP} V=4 Irms=162m Rser=0.395426 Lser=0 mfg="KEMET" pn="C0402C103K7PAC" type="X5R" IC=0
Ck3 SPIKE3 VGND {MEMCAP}
Cint3 VOUT3 VGND 100n
M33 N033 VPOS VDD VDD PMOS
M34 N036 vw N033 N033 PMOS
M35 N029 N036 VDD VDD PMOS
M36 SPIKE3 N029 VDD VDD PMOS
M37 N036 V2 VGND VGND NMOS
M38 N036 SPIKE3 VGND VGND NMOS
M39 VOUT3 Vint VGND VGND NMOST
M40 VDD SPIKE3 VOUT3 VOUT3 NMOSC
M41 N029 N036 VGND VGND NMOS
M42 SPIKE3 N029 N041 N041 NMOS
M43 N036 N029 VDD VDD PMOS
M44 N041 VREF VGND VGND NMOS
Cmem4 N053 VGND {MEMCAP} V=4 Irms=162m Rser=0.395426 Lser=0 mfg="KEMET" pn="C0402C103K7PAC" type="X5R" IC=0
Ck4 SPIKE4 VGND {MEMCAP}
Cint4 VOUT4 VGND 100n
M45 N051 VPOS VDD VDD PMOS
M46 N053 vw N051 N051 PMOS
M47 N049 N053 VDD VDD PMOS
M48 SPIKE4 N049 VDD VDD PMOS
M49 N053 V3 VGND VGND NMOS
M50 N053 SPIKE4 VGND VGND NMOS
M51 VOUT4 Vint VGND VGND NMOST
M52 VDD SPIKE4 VOUT4 VOUT4 NMOSC
M53 N049 N053 VGND VGND NMOS
M54 SPIKE4 N049 N055 N055 NMOS
M55 N053 N049 VDD VDD PMOS
M56 N055 VREF VGND VGND NMOS
Cmem5 N013 VGND {MEMCAP} V=4 Irms=162m Rser=0.395426 Lser=0 mfg="KEMET" pn="C0402C103K7PAC" type="X5R" IC=0
Ck5 SPIKE5 VGND {MEMCAP}
Cint5 VOUT5 VGND 100n
M57 N010 VNEG VDD VDD PMOS
M58 N013 vw N010 N010 PMOS
M59 N006 N013 VDD VDD PMOS
M60 SPIKE5 N006 VDD VDD PMOS
M61 N013 V0 VGND VGND NMOS
M62 N013 SPIKE5 VGND VGND NMOS
M63 VOUT5 Vint VGND VGND NMOST
M64 VDD SPIKE5 VOUT5 VOUT5 NMOSC
M65 N006 N013 VGND VGND NMOS
M66 SPIKE5 N006 N015 N015 NMOS
M67 N013 N006 VDD VDD PMOS
M68 N015 VREF VGND VGND NMOS
Cmem6 N026 VGND {MEMCAP} V=4 Irms=162m Rser=0.395426 Lser=0 mfg="KEMET" pn="C0402C103K7PAC" type="X5R" IC=0
Ck6 SPIKE6 VGND {MEMCAP}
Cint6 VOUT6 VGND 100n
M69 N023 VNEG VDD VDD PMOS
M70 N026 vw N023 N023 PMOS
M71 N021 N026 VDD VDD PMOS
M72 SPIKE6 N021 VDD VDD PMOS
M73 N026 V1 VGND VGND NMOS
M74 N026 SPIKE6 VGND VGND NMOS
M75 VOUT6 Vint VGND VGND NMOST
M76 VDD SPIKE6 VOUT6 VOUT6 NMOSC
M77 N021 N026 VGND VGND NMOS
M78 SPIKE6 N021 N028 N028 NMOS
M79 N026 N021 VDD VDD PMOS
M80 N028 VREF VGND VGND NMOS
Cmem7 N038 VGND {MEMCAP} V=4 Irms=162m Rser=0.395426 Lser=0 mfg="KEMET" pn="C0402C103K7PAC" type="X5R" IC=0
Ck7 SPIKE7 VGND {MEMCAP}
Cint7 VOUT7 VGND 100n
M81 N034 VNEG VDD VDD PMOS
M82 N038 vw N034 N034 PMOS
M83 N032 N038 VDD VDD PMOS
M84 SPIKE7 N032 VDD VDD PMOS
M85 N038 V2 VGND VGND NMOS
M86 N038 SPIKE7 VGND VGND NMOS
M87 VOUT7 Vint VGND VGND NMOST
M88 VDD SPIKE7 VOUT7 VOUT7 NMOSC
M89 N032 N038 VGND VGND NMOS
M90 SPIKE7 N032 N042 N042 NMOS
M91 N038 N032 VDD VDD PMOS
M92 N042 VREF VGND VGND NMOS
Cmem8 N054 VGND {MEMCAP} V=4 Irms=162m Rser=0.395426 Lser=0 mfg="KEMET" pn="C0402C103K7PAC" type="X5R" IC=0
Ck8 SPIKE8 VGND {MEMCAP}
Cint8 VOUT8 VGND 100n
M93 N052 VNEG VDD VDD PMOS
M94 N054 vw N052 N052 PMOS
M95 N050 N054 VDD VDD PMOS
M96 SPIKE8 N050 VDD VDD PMOS
M97 N054 V3 VGND VGND NMOS
M98 N054 SPIKE8 VGND VGND NMOS
M99 VOUT8 Vint VGND VGND NMOST
M100 VDD SPIKE8 VOUT8 VOUT8 NMOSC
M101 N050 N054 VGND VGND NMOS
M102 SPIKE8 N050 N056 N056 NMOS
M103 N054 N050 VDD VDD PMOS
M104 N056 VREF VGND VGND NMOS
V3 V0 0 790m
R1 V0 V1 10k
R2 V1 V2 10k
R3 V2 V3 10k
R4 V3 0 450k
V5 N031 0 790m
V6 N030 0 790m
V7 N035 0 790m
.model D D
.lib standard.dio
.model NMOS NMOS
.model PMOS PMOS
.lib standard.mos
.tran 1
.option noopiter
.param LR=1k
.param LRB=1K
.param c=1u
.model NMOST nmos (L=90n W=40n)
.model NMOSC nmos (L=90n W=180n)
.model nmos nmos (L={NMOSL} W={NMOSW})
.model pmos pmos (L={PMOSL} W={PMOSW})
.param NMOSL = {90n*(1+gauss(tol/3))}
.param NMOSW = {90n*(1+gauss(tol/3))}
.param PMOSL = {90n*(1+gauss(tol/3))}
.param PMOSW ={90n*(1+gauss(tol/3))}
.param MEMCAP = {10n*(1+gauss(tol/3))}
.param tol=0.17
.step param x 0 100 1
.lib LTC.lib
.backanno
.end